# Altium project Dashcam_V2.0E.PrjPcb (part 2 of 8)

## Sheet CPU MISC.SchDoc: CPU MISC
size A3; DrawnBy: UKAYACIK; Engineer: UKAYACIK; DocumentNumber: 6; Revision: B; SheetNumber: 7; SheetTotal: 21
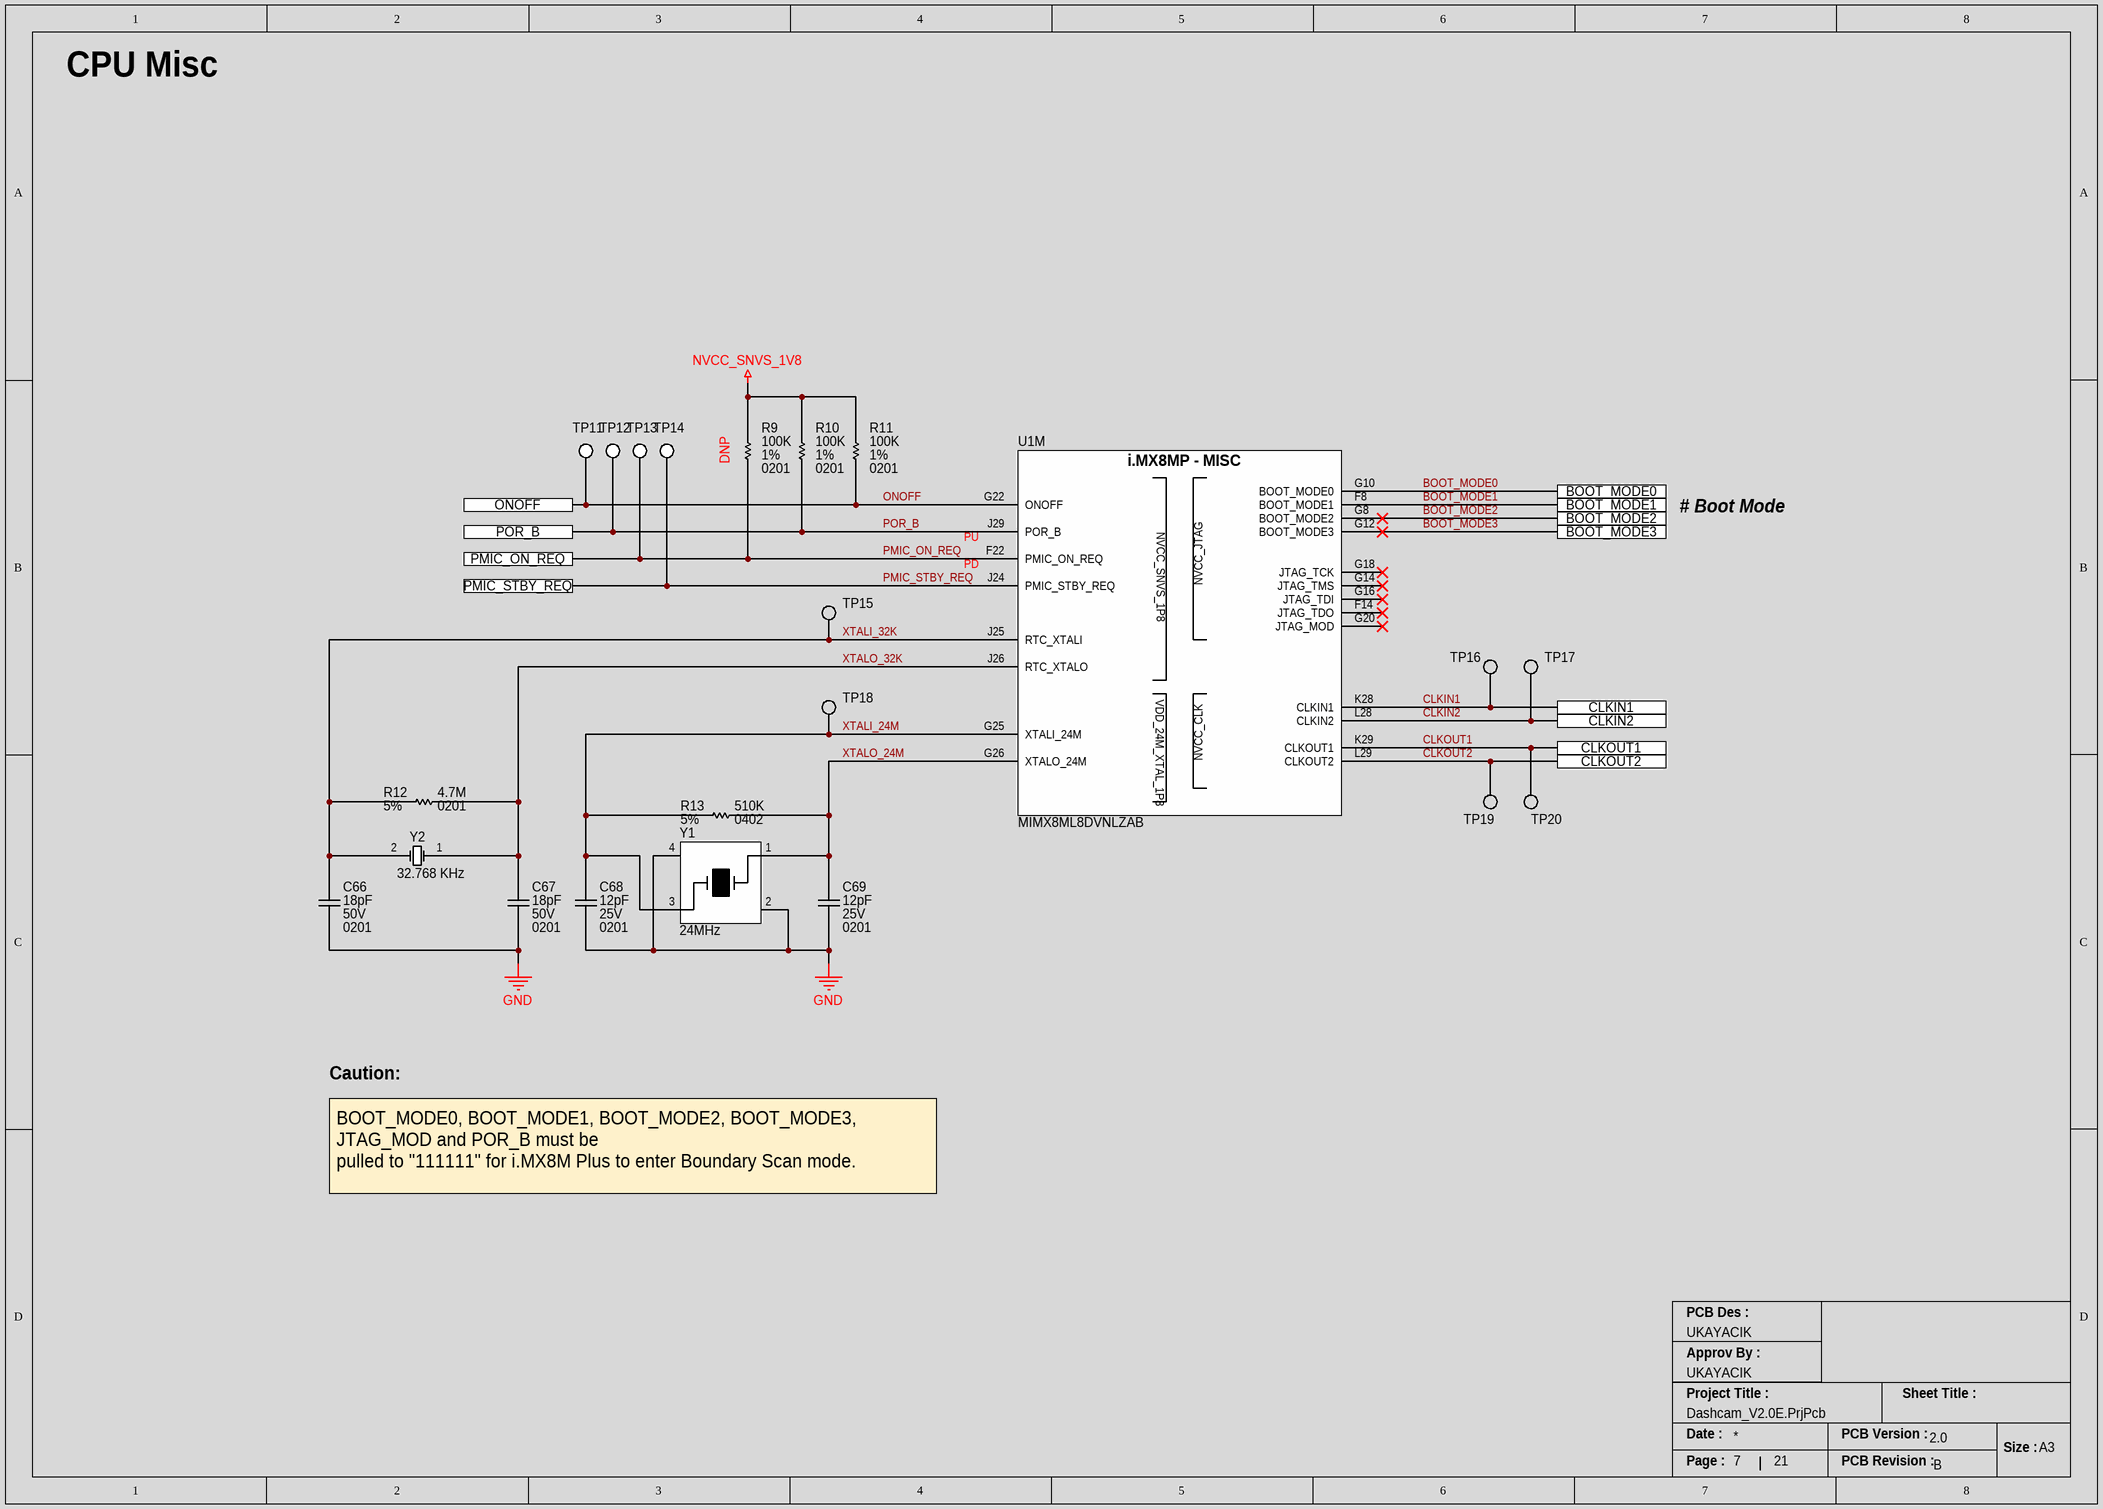
[diagram p7: CPU MISC.SchDoc]

### Parts
C66  Capacitance: 18pF  Voltage Rating: 50V  Case/Package: 0201  [CAP_0201_CAPC0603X03N]  (hidden comment: GRM0335C1H180JA01D)
C67  Capacitance: 18pF  Voltage Rating: 50V  Case/Package: 0201  [CAP_0201_CAPC0603X03N]  (hidden comment: GRM0335C1H180JA01D)
C68  Voltage Rating: 25V  Capacitance: 12pF  Case/Package: 0201  [CAP_0201_CAPC0603X03N]  (hidden comment: CGA1A2C0G1E120J030BA)
C69  Voltage Rating: 25V  Capacitance: 12pF  Case/Package: 0201  [CAP_0201_CAPC0603X03N]  (hidden comment: CGA1A2C0G1E120J030BA)
R9  Resistance: 100K  Tolerance: 1%  Case/Package: 0201  [RES_0201_RESC0603X02N]  (hidden comment: RC0201FR-07100KL)
R10  Resistance: 100K  Tolerance: 1%  Case/Package: 0201  [RES_0201_RESC0603X02N]  (hidden comment: RC0201FR-07100KL)
R11  Resistance: 100K  Tolerance: 1%  Case/Package: 0201  [RES_0201_RESC0603X02N]  (hidden comment: RC0201FR-07100KL)
R12  Tolerance: 5%  Resistance: 4.7M  Case/Package: 0201  [RES_0201_RESC0603X02N]  (hidden comment: RC0201JR-074M7L)
R13  Tolerance: 5%  Resistance: 510K  Case/Package: 0402  [RES_0402_RESC1005X04N]  (hidden comment: ERJ-2GEJ514X)
TP11  NO COMPONENT  [TP_PAD_0.8MM_SMD_ROUND]  (value not drawn)  (no BOM)
TP12  NO COMPONENT  [TP_PAD_0.8MM_SMD_ROUND]  (value not drawn)  (no BOM)
TP13  NO COMPONENT  [TP_PAD_0.8MM_SMD_ROUND]  (value not drawn)  (no BOM)
TP14  NO COMPONENT  [TP_PAD_0.8MM_SMD_ROUND]  (value not drawn)  (no BOM)
TP15  NO COMPONENT  [TP_PAD_0.5MM_SMD_ROUND]  (value not drawn)  (no BOM)
TP16  NO COMPONENT  [TP_PAD_0.5MM_SMD_ROUND]  (value not drawn)  (no BOM)
TP17  NO COMPONENT  [TP_PAD_0.5MM_SMD_ROUND]  (value not drawn)  (no BOM)
TP18  NO COMPONENT  [TP_PAD_0.5MM_SMD_ROUND]  (value not drawn)  (no BOM)
TP19  NO COMPONENT  [TP_PAD_0.5MM_SMD_ROUND]  (value not drawn)  (no BOM)
TP20  NO COMPONENT  [TP_PAD_0.5MM_SMD_ROUND]  (value not drawn)  (no BOM)
U1  MIMX8ML8DVNLZAB  [IC_MPU_BGA548C50P29X29_1500X1500X148]  (part M of 15)
Y1  Frequency: 24MHz  [CRYSTAL_24MHz_OSCCC320X250X60]  (hidden comment: TSX-3225 24.0000MF15X-AC3)
Y2  Operating Frequency: 32.768 KHz  [CRYSTAL_ABS07-32.768KHZ-T]  (hidden comment: ABS07-32.768KHZ-T)

### Ports
BOOT_MODE0, BOOT_MODE1, BOOT_MODE2, BOOT_MODE3, CLKIN1, CLKIN2, CLKOUT1, CLKOUT2, ONOFF, PMIC_ON_REQ, PMIC_STBY_REQ, POR_B

### Nets
GND: C66.1 C67.1 C68.1 C69.1 Y1.2 Y1.4
NVCC_SNVS_1V8: R9.2 R10.2 R11.2
BOOT_MODE0: U1.G10(BOOT_MODE0) ; port BOOT_MODE0
BOOT_MODE1: U1.F8(BOOT_MODE1) ; port BOOT_MODE1
BOOT_MODE2: U1.G8(BOOT_MODE2) ; port BOOT_MODE2
BOOT_MODE3: U1.G12(BOOT_MODE3) ; port BOOT_MODE3
CLKIN1: TP16.1 U1.K28(CLKIN1) ; port CLKIN1
CLKIN2: TP17.1 U1.L28(CLKIN2) ; port CLKIN2
CLKOUT1: TP20.1 U1.K29(CLKOUT1) ; port CLKOUT1
CLKOUT2: TP19.1 U1.L29(CLKOUT2) ; port CLKOUT2
ONOFF: R11.1 TP11.1 U1.G22(ONOFF) ; port ONOFF
PMIC_ON_REQ: R9.1 TP13.1 U1.F22(PMIC_ON_REQ) ; port PMIC_ON_REQ
PMIC_STBY_REQ: TP14.1 U1.J24(PMIC_STBY_REQ) ; port PMIC_STBY_REQ
POR_B: R10.1 TP12.1 U1.J29(POR_B) ; port POR_B
XTALI_24M: C68.2 R13.1 TP18.1 U1.G25(XTALI_24M) Y1.3
XTALI_32K: C66.2 R12.1 TP15.1 U1.J25(RTC_XTALI) Y2.2(OSC2)
XTALO_24M: C69.2 R13.2 U1.G26(XTALO_24M) Y1.1
XTALO_32K: C67.2 R12.2 U1.J26(RTC_XTALO) Y2.1(OSC1)

Not connected (* = marked no-connect by the designer): U1 F14(JTAG_TDO)* G14(JTAG_TMS)* G16(JTAG_TDI)* G18(JTAG_TCK)* G20(JTAG_MOD)*

### Notes on the sheet
- CPU Misc
- (near R9) DNP
- # Boot Mode
- (near U1) PD
- (near U1) PU
- Caution:
- BOOT_MODE0, BOOT_MODE1, BOOT_MODE2, BOOT_MODE3, JTAG_MOD and POR_B must be
  pulled to "111111" for i.MX8M Plus to enter Boundary Scan mode.
- PCB Des :
- Approv By :
- Project Title :
- Sheet Title :
- Date :
- PCB Version :
- Size :
- A3
- Page :
- PCB Revision :
- (in symbol IC_MPU_8M_PLUS_MIMX8ML8DVNLZAB, part M) i.MX8MP - MISC

### Library data of the parts
C66 C67 = CAP_18PF_50V_NP0_0201: Multilayer Ceramic Capacitor, 18 pF, 50 V, ± 5%, C0G (NP0), 0201 [0603 Metric]; Manufacturer: Murata; Temperature Coefficient: 30ppm/°C; Supplier 1: Digikey; Manufacturer Part Number: GRM0335C1H180JA01D; RoHS: Yes; Category: Ceramic Capacitors; Stock 1: 464126; Pricing 1: 1=0.1, 10=0.011, 50=0.0062, 100=0.0048, 500=0.0036, 1000=0.00283, 2500=0.00258, 5000=0.00237 (USD); Mount: Surface Mount; Case Code (Metric): 0603; Case Code (Imperial): 0201; Material: Ceramic; Min Operating Temperature: -55°C; Max Operating Temperature: 125°C; Package Quantity: 15000; Packaging: Tape and Reel; Voltage Rating (DC): 50V; Termination: SMD/SMT; Series: GRM; Dielectric: C0G; Tolerance: 5%; Voltage: 50V; Length: 0.6mm; Width: 0.3mm; Height: 0.3mm; Depth: 0.3mm; Radiation Hardening: No; RoHS Compliant: Yes; Lead Free: Lead Free; Supplier Part Number 1: 490-6117-1-ND
C68 C69 = CAP_12PF_25V_NP0_0201: CAPACITORS CERAMIC, 12PF, 5%, 25V, C0G, 0201[0603]; Product Range: TDK - CGA Seri; Supplier 1: Mouser; Manufacturer: TDK; Manufacturer Part Number: CGA1A2C0G1E120J030BA; RoHS: Yes; Category: Ceramic Capacitors; Stock 1: 58112; Pricing 1: 1=0.1, 10=0.041, 50=0.041, 100=0.024, 1000=0.017, 10000=0.014 (USD); Mount: Surface Mount; Case Code (Metric): 0603; Case Code (Imperial): 0201; Weight: 6E-06oz; Min Operating Temperature: -55°C; Max Operating Temperature: 125°C; Tolerance: 5%; Packaging: Tape and Reel; Termination: SMD/SMT; Series: CGA; Package Quantity: 15000; Voltage Rating (DC): 25V; Dielectric: C0G; Length: 0.6mm; Width: 0.3mm; Height: 0.3mm; Depth: 0.3mm; Ratings: AEC-Q200; RoHS Compliant: Yes; ComponentLink1URL: https://datasheet.ciiva.com/24221/cga1a2c0g1e120j030ba-271847-24221437.pdf?src-supplier=Mouser; ComponentLink1Description: https://datasheet.ciiva.com/24221/cga1a2c0g1e120j030ba-271847-24221437.pdf?src-supplier=Mouser; Supplier Part Number 1: 810-CGA1A2C0G1E120J
R9-R11 = RES_100K_1%_50mW_0201: SMD Chip Resistor, 100 kOhm, ± 1%, 50 mW, 0201 [0603 Metric], Thick Film, General Purpose; Manufacturer: Yageo; Temperature Coefficient: 200ppm/°C; Power Rating: 50mW; Voltage Rating: 25V; Supplier 1: Digikey; Manufacturer Part Number: RC0201FR-07100KL; RoHS: Yes; Category: Chip SMD Resistors; Stock 1: 2564699; Pricing 1: 1=0.1, 10=0.027, 50=0.0172, 100=0.0143, 500=0.00988, 1000=0.00854, 5000=0.00629 (USD); Number of Pins: 2NUMBER; Contact Plating: Tin,Matte; Case Code (Imperial): 0201; Case Code (Metric): 0603; Size Code: 0201; Min Operating Temperature: -55°C; Max Operating Temperature: 125°C; Resistor Type: Thick Film; Packaging: Tape and Reel; Package Quantity: 10000; Termination: SMD/SMT; Number of Terminations: 2; Max Power Dissipation: 50mW; Features: Moisture Resistant; Series: RC; Resistance Tolerance: 1%; Construction: Rectangular; Voltage Rating (DC): 25V; Length: 0.024inch; Width: 0.012inch; Height: 0.01inch; Depth: 0.3mm; Reach SVHC Compliant: No; Military Standard: Not; RoHS Compliant: Yes; Lead Free: 5697LeadFree; ComponentLink1URL: https://datasheet.ciiva.com/2493/pyu-r-int-thick-7-2493769.pdf?src-supplier=Digikey; ComponentLink1Description: https://datasheet.ciiva.com/2493/pyu-r-int-thick-7-2493769.pdf?src-supplier=Digikey; ComponentLink2URL: https://datasheet.ciiva.com/2493/pyu-r-int-thick-7-2493770.pdf?src-supplier=Digikey; ComponentLink2Description: https://datasheet.ciiva.com/2493/pyu-r-int-thick-7-2493770.pdf?src-supplier=Digikey; ComponentLink3URL: https://datasheet.ciiva.com/2493/pyu-r-int-thick-7-2493771.pdf?src-supplier=Digikey; ComponentLink3Description: https://datasheet.ciiva.com/2493/pyu-r-int-thick-7-2493771.pdf?src-supplier=Digikey; ComponentLink4URL: https://datasheet.ciiva.com/26829/getdatasheetpartid-420441-26829850.pdf?src-supplier=Verical; ComponentLink4Description: https://datasheet.ciiva.com/26829/getdatasheetpartid-420441-26829850.pdf?src-supplier=Verical; ComponentLink5URL: https://datasheet.ciiva.com/22698/1563626-22698495.pdf?src-supplier=Element14; ComponentLink5Description: https://datasheet.ciiva.com/22698/1563626-22698495.pdf?src-supplier=Element14; ComponentLink6URL: https://datasheet.ciiva.com/7660/1421516-7660806.pdf?src-supplier=Element14; ComponentLink6Description: https://datasheet.ciiva.com/7660/1421516-7660806.pdf?src-supplier=Element14; ComponentLink7URL: https://datasheet.ciiva.com/46391/1421516-46391338.pdf?src-supplier=Element14; ComponentLink7Description: https://datasheet.ciiva.com/46391/1421516-46391338.pdf?src-supplier=Element14; Supplier Part Number 1: 311-100KMDKR-ND
R12 = RES_4.7M_5%_50mW_0201: SMD Chip Resistor, 4.7 MOhm, ± 5%, 50 mW, 0201 [0603 Metric], Thick Film, General Purpose; Manufacturer: Yageo; Max Power Dissipation: 50mW; Temperature Coefficient: 200ppm/°C; Supplier 1: Digikey; Manufacturer Part Number: RC0201JR-074M7L; RoHS: Yes; Category: Chip SMD Resistors; Stock 1: 74834; Pricing 1: 1=0.1, 10=0.021, 50=0.0132, 100=0.011, 500=0.00746, 1000=0.00643, 5000=0.00468 (USD); Case Code (Metric): 0603; Case Code (Imperial): 0201; Min Operating Temperature: -55°C; Max Operating Temperature: 125°C; Packaging: Cut Tape; Number of Terminations: 2; Features: Moisture Resistant; Series: RC; RoHS Compliant: Yes; ComponentLink1URL: http://www.yageo.com/documents/recent/PYu-RC_Group_51_RoHS_L_9.pdf?src-supplier=Digikey; ComponentLink1Description: http://www.yageo.com/documents/recent/PYu-RC_Group_51_RoHS_L_9.pdf?src-supplier=Digikey; ComponentLink2URL: https://www.yageo.com/upload/media/product/productsearch/datasheet/rchip/PYu-RC_Group_51_RoHS_L_11.pdf?src-supplier=Digikey; ComponentLink2Description: https://www.yageo.com/upload/media/product/productsearch/datasheet/rchip/PYu-RC_Group_51_RoHS_L_11.pdf?src-supplier=Digikey; ComponentLink3URL: https://datasheet.octopart.com/RC0201JR-074M7L-Yageo-datasheet-164759695.pdf?src-supplier=Future+Electronics; ComponentLink3Description: https://datasheet.octopart.com/RC0201JR-074M7L-Yageo-datasheet-164759695.pdf?src-supplier=Future+Electronics; Supplier Part Number 1: YAG2904CT-ND
R13 = RES_510K_5%_100mW_0402: SMD Chip Resistor, 510 kOhm, ± 5%, 100 mW, 0402 [1005 Metric], Thick Film, General Purpose; Manufacturer: Panasonic; Power Rating: 100mW; Voltage Rating: 50V; Temperature Coefficient: 200ppm/°C; Supplier 1: Digikey; Manufacturer Part Number: ERJ-2GEJ514X; RoHS: Yes; Category: Chip SMD Resistors; Stock 1: 171465; Pricing 1: 1=0.1, 10=0.022, 50=0.0134, 100=0.0112, 500=0.00758, 1000=0.00651, 5000=0.00473 (USD); Mount: Surface Mount; Case Code (Imperial): 0402; Case Code (Metric): 1005; Weight: 2.8E-05oz; Contact Plating: Tin; Min Operating Temperature: -55°C; Max Operating Temperature: 155°C; Packaging: Tape and Reel; Package Quantity: 10000; Resistor Type: Thick Film; Number of Terminations: 2; Max Power Dissipation: 100mW; Voltage Rating (DC): 50V; Features: Automotive AEC-Q200; Series: ERJ; Resistance Tolerance: 5%; Termination: SMD/SMT; Construction: Rectangular; Technology: THICK FILM; Length: 1mm; Width: 0.5mm; Height: 0.35mm; Depth: 0.5mm; Ratings: AEC-Q200; Radiation Hardening: No; Reach SVHC Compliant: No; Lead Free: Lead Free; RoHS Compliant: Yes; Military Standard: Not; ComponentLink1URL: https://datasheet.ciiva.com/11821/0900766b80f806dd-11821324.pdf?src-supplier=Rs; ComponentLink1Description: https://datasheet.ciiva.com/11821/0900766b80f806dd-11821324.pdf?src-supplier=Rs; ComponentLink2URL: https://datasheet.ciiva.com/30121/4aoa0000ce1-30121622.pdf?src-supplier=Onlinecomponents.com; ComponentLink2Description: https://datasheet.ciiva.com/30121/4aoa0000ce1-30121622.pdf?src-supplier=Onlinecomponents.com; ComponentLink3URL: https://datasheet.ciiva.com/8079/1678796-8079437.pdf?src-supplier=Element14; ComponentLink3Description: https://datasheet.ciiva.com/8079/1678796-8079437.pdf?src-supplier=Element14; Supplier Part Number 1: P510KJCT-ND
TP11-TP14 = TP_PAD_SMD_Round: Test Point, SMD pad, round, 1.5mm, 1.6mm, 3mm diameter
TP15-TP20 = TP_PAD_SMD_SMALL: as TP21 on sheet CPU IO
U1 = IC_MPU_8M_PLUS_MIMX8ML8DVNLZAB: as U1 on sheet CPU IO; Supplier 1: Arrow Electronics; Manufacturer Part Number: MIMX8ML8DVNLZAB; RoHS: Yes; Category: Microprocessors; Stock 1: 1036; Pricing 1: 1=54.8, 5=52.24, 10=44.19, 25=42.8, 50=39.95, 100=31.83 (USD); Supplier Part Number 1: MIMX8ML8DVNLZAB
Y1 = CRYSTAL_EPSON_24MHz_TSX-3225 24.0000MF15X-AC3: 24 MHz ±10ppm Crystal 9pF 40 Ohms 4-SMD, No Lead; Manufacturer: Epson; Supplier 1: Digi-Key; Manufacturer Part Number: TSX-3225 24.0000MF15X-AC3; RoHS: Yes; Category: Crystals; Mount: Surface Mount; Case/Package: SMD/SMT; Min Operating Temperature: -40°C; Max Operating Temperature: 85°C; Load Capacitance: 9pF; Frequency Tolerance: 10ppm; Series: FC-135; RoHS Compliant: Yes
Y2 = CRYSTAL_ABRACON_32.768KHz_ABS07-32.768KHZ-T: Crystal 0.032768MHz ±20ppm (Tol) 12.5pF Flexural 70000Ohm 2-Pin CSMD T/R; ESR (Equivalent Series Resistance): 70kR; Supplier 1: Digikey; Manufacturer: Abracon; Manufacturer Part Number: ABS07-32.768KHZ-T; RoHS: Yes; Category: Crystals; Stock 1: 1583168; Pricing 1: 1=0.69, 10=0.576, 50=0.5184, 100=0.4607, 500=0.43768, 1000=0.36858 (USD); Case/Package: CSMD; Number of Pins: 2; Min Operating Temperature: -40°C; Max Operating Temperature: 85°C; Frequency Tolerance: 20ppm; Load Capacitance: 12.5pF; Frequency: 32.768kHz; Packaging: Tape and Reel; Series: ABS07; Package Quantity: 3000; Tolerance: 20ppm; Termination: SMD/SMT; Series Resistance: 70kR; Length: 3.2mm; Width: 1.5mm; Height: 0.9mm; Depth: 1.5mm; Radiation Hardening: No; RoHS Compliant: Yes; Lead Free: Lead Free; Reach SVHC Compliant: No; ComponentLink1URL: https://datasheet.ciiva.com/7998/1912628-7998667.pdf?src-supplier=Element14; ComponentLink1Description: https://datasheet.ciiva.com/7998/1912628-7998667.pdf?src-supplier=Element14; ComponentLink2URL: https://datasheet.ciiva.com/1357/1883680-1357319.pdf?src-supplier=Element14; ComponentLink2Description: https://datasheet.ciiva.com/1357/1883680-1357319.pdf?src-supplier=Element14; ComponentLink3URL: https://datasheet.ciiva.com/854/abs07-854936.pdf?src-supplier=Digikey; ComponentLink3Description: https://datasheet.ciiva.com/854/abs07-854936.pdf?src-supplier=Digikey; ComponentLink4URL: https://datasheet.ciiva.com/854/abs07-854935.pdf?src-supplier=Digikey; ComponentLink4Description: https://datasheet.ciiva.com/854/abs07-854935.pdf?src-supplier=Digikey; ComponentLink5URL: https://datasheet.ciiva.com/854/abs07-854937.pdf?src-supplier=Digikey; ComponentLink5Description: https://datasheet.ciiva.com/854/abs07-854937.pdf?src-supplier=Digikey; ComponentLink6URL: https://datasheet.ciiva.com/4944/abs07-11028-4944830.pdf?src-supplier=Mouser; ComponentLink6Description: https://datasheet.ciiva.com/4944/abs07-11028-4944830.pdf?src-supplier=Mouser; Supplier Part Number 1: 535-9542-1-ND

## Sheet CPU Power.SchDoc: CPU POWER
size A2; DrawnBy: UKAYACIK; Engineer: UKAYACIK; DocumentNumber: 3; Revision: B; SheetNumber: 4; SheetTotal: 21
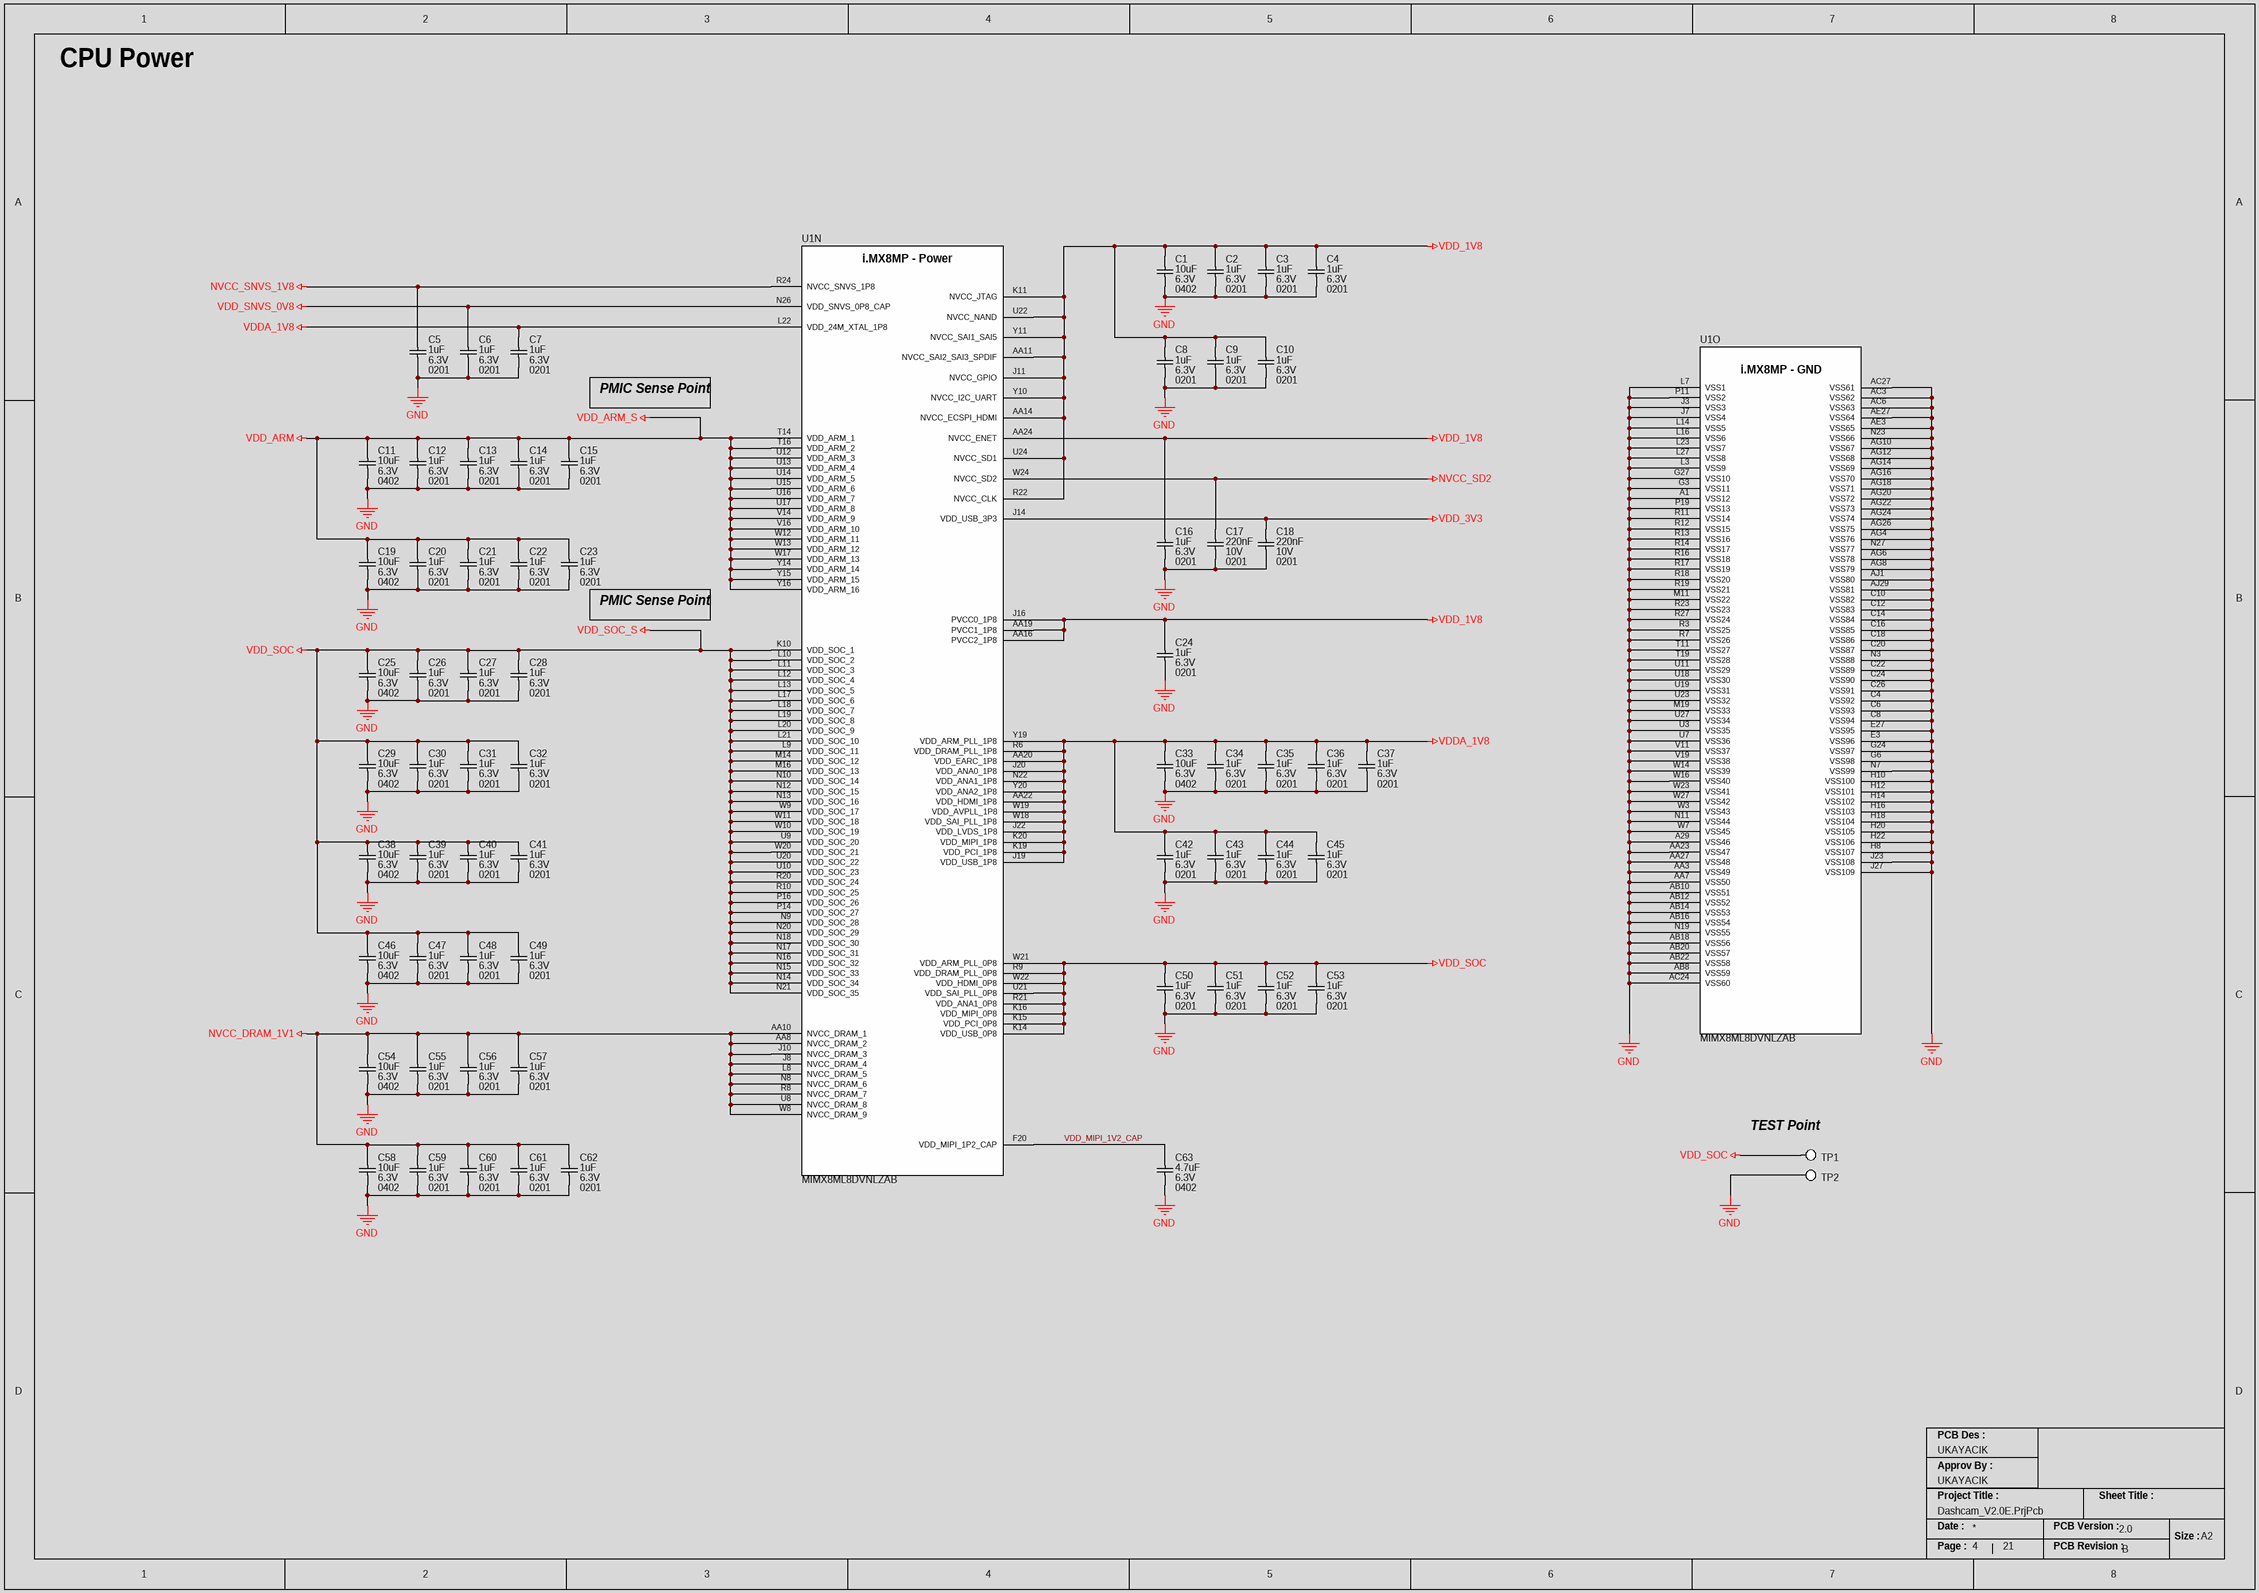
[diagram p8: CPU Power.SchDoc]

### Parts
C1  Case/Package: 0402  Capacitance: 10uF  Voltage Rating: 6.3V  [CAP_0402_CAPC1005X05N]  (hidden comment: CL05A106MQ5NUNC)
C2  Voltage Rating (DC): 6.3V  Capacitance: 1uF  Case/Package: 0201  [CAP_0201_CAPC0603X03N]  (hidden comment: 02016D105MAT2A)
C3  Voltage Rating (DC): 6.3V  Capacitance: 1uF  Case/Package: 0201  [CAP_0201_CAPC0603X03N]  (hidden comment: 02016D105MAT2A)
C4  Voltage Rating (DC): 6.3V  Capacitance: 1uF  Case/Package: 0201  [CAP_0201_CAPC0603X03N]  (hidden comment: 02016D105MAT2A)
C5  Voltage Rating (DC): 6.3V  Capacitance: 1uF  Case/Package: 0201  [CAP_0201_CAPC0603X03N]  (hidden comment: 02016D105MAT2A)
C6  Voltage Rating (DC): 6.3V  Capacitance: 1uF  Case/Package: 0201  [CAP_0201_CAPC0603X03N]  (hidden comment: 02016D105MAT2A)
C7  Voltage Rating (DC): 6.3V  Capacitance: 1uF  Case/Package: 0201  [CAP_0201_CAPC0603X03N]  (hidden comment: 02016D105MAT2A)
C8  Voltage Rating (DC): 6.3V  Capacitance: 1uF  Case/Package: 0201  [CAP_0201_CAPC0603X03N]  (hidden comment: 02016D105MAT2A)
C9  Voltage Rating (DC): 6.3V  Capacitance: 1uF  Case/Package: 0201  [CAP_0201_CAPC0603X03N]  (hidden comment: 02016D105MAT2A)
C10  Voltage Rating (DC): 6.3V  Capacitance: 1uF  Case/Package: 0201  [CAP_0201_CAPC0603X03N]  (hidden comment: 02016D105MAT2A)
C11  Case/Package: 0402  Capacitance: 10uF  Voltage Rating: 6.3V  [CAP_0402_CAPC1005X05N]  (hidden comment: CL05A106MQ5NUNC)
C12  Voltage Rating (DC): 6.3V  Capacitance: 1uF  Case/Package: 0201  [CAP_0201_CAPC0603X03N]  (hidden comment: 02016D105MAT2A)
C13  Voltage Rating (DC): 6.3V  Capacitance: 1uF  Case/Package: 0201  [CAP_0201_CAPC0603X03N]  (hidden comment: 02016D105MAT2A)
C14  Voltage Rating (DC): 6.3V  Capacitance: 1uF  Case/Package: 0201  [CAP_0201_CAPC0603X03N]  (hidden comment: 02016D105MAT2A)
C15  Voltage Rating (DC): 6.3V  Capacitance: 1uF  Case/Package: 0201  [CAP_0201_CAPC0603X03N]  (hidden comment: 02016D105MAT2A)
C16  Voltage Rating (DC): 6.3V  Capacitance: 1uF  Case/Package: 0201  [CAP_0201_CAPC0603X03N]  (hidden comment: 02016D105MAT2A)
C17  Voltage Rating (DC): 10V  Capacitance: 220nF  Case/Package: 0201  [CAP_0201_CAPC0603X03N]  (hidden comment: LMK063BJ224MP-F)
C18  Voltage Rating (DC): 10V  Capacitance: 220nF  Case/Package: 0201  [CAP_0201_CAPC0603X03N]  (hidden comment: LMK063BJ224MP-F)
C19  Case/Package: 0402  Capacitance: 10uF  Voltage Rating: 6.3V  [CAP_0402_CAPC1005X05N]  (hidden comment: CL05A106MQ5NUNC)
C20  Voltage Rating (DC): 6.3V  Capacitance: 1uF  Case/Package: 0201  [CAP_0201_CAPC0603X03N]  (hidden comment: 02016D105MAT2A)
C21  Voltage Rating (DC): 6.3V  Capacitance: 1uF  Case/Package: 0201  [CAP_0201_CAPC0603X03N]  (hidden comment: 02016D105MAT2A)
C22  Voltage Rating (DC): 6.3V  Capacitance: 1uF  Case/Package: 0201  [CAP_0201_CAPC0603X03N]  (hidden comment: 02016D105MAT2A)
C23  Voltage Rating (DC): 6.3V  Capacitance: 1uF  Case/Package: 0201  [CAP_0201_CAPC0603X03N]  (hidden comment: 02016D105MAT2A)
C24  Voltage Rating (DC): 6.3V  Capacitance: 1uF  Case/Package: 0201  [CAP_0201_CAPC0603X03N]  (hidden comment: 02016D105MAT2A)
C25  Case/Package: 0402  Capacitance: 10uF  Voltage Rating: 6.3V  [CAP_0402_CAPC1005X05N]  (hidden comment: CL05A106MQ5NUNC)
C26  Voltage Rating (DC): 6.3V  Capacitance: 1uF  Case/Package: 0201  [CAP_0201_CAPC0603X03N]  (hidden comment: 02016D105MAT2A)
C27  Voltage Rating (DC): 6.3V  Capacitance: 1uF  Case/Package: 0201  [CAP_0201_CAPC0603X03N]  (hidden comment: 02016D105MAT2A)
C28  Voltage Rating (DC): 6.3V  Capacitance: 1uF  Case/Package: 0201  [CAP_0201_CAPC0603X03N]  (hidden comment: 02016D105MAT2A)
C29  Case/Package: 0402  Capacitance: 10uF  Voltage Rating: 6.3V  [CAP_0402_CAPC1005X05N]  (hidden comment: CL05A106MQ5NUNC)
C30  Voltage Rating (DC): 6.3V  Capacitance: 1uF  Case/Package: 0201  [CAP_0201_CAPC0603X03N]  (hidden comment: 02016D105MAT2A)
C31  Voltage Rating (DC): 6.3V  Capacitance: 1uF  Case/Package: 0201  [CAP_0201_CAPC0603X03N]  (hidden comment: 02016D105MAT2A)
C32  Voltage Rating (DC): 6.3V  Capacitance: 1uF  Case/Package: 0201  [CAP_0201_CAPC0603X03N]  (hidden comment: 02016D105MAT2A)
C33  Case/Package: 0402  Capacitance: 10uF  Voltage Rating: 6.3V  [CAP_0402_CAPC1005X05N]  (hidden comment: CL05A106MQ5NUNC)
C34  Voltage Rating (DC): 6.3V  Capacitance: 1uF  Case/Package: 0201  [CAP_0201_CAPC0603X03N]  (hidden comment: 02016D105MAT2A)
C35  Voltage Rating (DC): 6.3V  Capacitance: 1uF  Case/Package: 0201  [CAP_0201_CAPC0603X03N]  (hidden comment: 02016D105MAT2A)
C36  Voltage Rating (DC): 6.3V  Capacitance: 1uF  Case/Package: 0201  [CAP_0201_CAPC0603X03N]  (hidden comment: 02016D105MAT2A)
C37  Voltage Rating (DC): 6.3V  Capacitance: 1uF  Case/Package: 0201  [CAP_0201_CAPC0603X03N]  (hidden comment: 02016D105MAT2A)
C38  Case/Package: 0402  Capacitance: 10uF  Voltage Rating: 6.3V  [CAP_0402_CAPC1005X05N]  (hidden comment: CL05A106MQ5NUNC)
C39  Voltage Rating (DC): 6.3V  Capacitance: 1uF  Case/Package: 0201  [CAP_0201_CAPC0603X03N]  (hidden comment: 02016D105MAT2A)
C40  Voltage Rating (DC): 6.3V  Capacitance: 1uF  Case/Package: 0201  [CAP_0201_CAPC0603X03N]  (hidden comment: 02016D105MAT2A)
C41  Voltage Rating (DC): 6.3V  Capacitance: 1uF  Case/Package: 0201  [CAP_0201_CAPC0603X03N]  (hidden comment: 02016D105MAT2A)
C42  Voltage Rating (DC): 6.3V  Capacitance: 1uF  Case/Package: 0201  [CAP_0201_CAPC0603X03N]  (hidden comment: 02016D105MAT2A)
C43  Voltage Rating (DC): 6.3V  Capacitance: 1uF  Case/Package: 0201  [CAP_0201_CAPC0603X03N]  (hidden comment: 02016D105MAT2A)
C44  Voltage Rating (DC): 6.3V  Capacitance: 1uF  Case/Package: 0201  [CAP_0201_CAPC0603X03N]  (hidden comment: 02016D105MAT2A)
C45  Voltage Rating (DC): 6.3V  Capacitance: 1uF  Case/Package: 0201  [CAP_0201_CAPC0603X03N]  (hidden comment: 02016D105MAT2A)
C46  Case/Package: 0402  Capacitance: 10uF  Voltage Rating: 6.3V  [CAP_0402_CAPC1005X05N]  (hidden comment: CL05A106MQ5NUNC)
C47  Voltage Rating (DC): 6.3V  Capacitance: 1uF  Case/Package: 0201  [CAP_0201_CAPC0603X03N]  (hidden comment: 02016D105MAT2A)
C48  Voltage Rating (DC): 6.3V  Capacitance: 1uF  Case/Package: 0201  [CAP_0201_CAPC0603X03N]  (hidden comment: 02016D105MAT2A)
C49  Voltage Rating (DC): 6.3V  Capacitance: 1uF  Case/Package: 0201  [CAP_0201_CAPC0603X03N]  (hidden comment: 02016D105MAT2A)
C50  Voltage Rating (DC): 6.3V  Capacitance: 1uF  Case/Package: 0201  [CAP_0201_CAPC0603X03N]  (hidden comment: 02016D105MAT2A)
C51  Voltage Rating (DC): 6.3V  Capacitance: 1uF  Case/Package: 0201  [CAP_0201_CAPC0603X03N]  (hidden comment: 02016D105MAT2A)
C52  Voltage Rating (DC): 6.3V  Capacitance: 1uF  Case/Package: 0201  [CAP_0201_CAPC0603X03N]  (hidden comment: 02016D105MAT2A)
C53  Voltage Rating (DC): 6.3V  Capacitance: 1uF  Case/Package: 0201  [CAP_0201_CAPC0603X03N]  (hidden comment: 02016D105MAT2A)
C54  Case/Package: 0402  Capacitance: 10uF  Voltage Rating: 6.3V  [CAP_0402_CAPC1005X05N]  (hidden comment: CL05A106MQ5NUNC)
C55  Voltage Rating (DC): 6.3V  Capacitance: 1uF  Case/Package: 0201  [CAP_0201_CAPC0603X03N]  (hidden comment: 02016D105MAT2A)
C56  Voltage Rating (DC): 6.3V  Capacitance: 1uF  Case/Package: 0201  [CAP_0201_CAPC0603X03N]  (hidden comment: 02016D105MAT2A)
C57  Voltage Rating (DC): 6.3V  Capacitance: 1uF  Case/Package: 0201  [CAP_0201_CAPC0603X03N]  (hidden comment: 02016D105MAT2A)
C58  Case/Package: 0402  Capacitance: 10uF  Voltage Rating: 6.3V  [CAP_0402_CAPC1005X05N]  (hidden comment: CL05A106MQ5NUNC)
C59  Voltage Rating (DC): 6.3V  Capacitance: 1uF  Case/Package: 0201  [CAP_0201_CAPC0603X03N]  (hidden comment: 02016D105MAT2A)
C60  Voltage Rating (DC): 6.3V  Capacitance: 1uF  Case/Package: 0201  [CAP_0201_CAPC0603X03N]  (hidden comment: 02016D105MAT2A)
C61  Voltage Rating (DC): 6.3V  Capacitance: 1uF  Case/Package: 0201  [CAP_0201_CAPC0603X03N]  (hidden comment: 02016D105MAT2A)
C62  Voltage Rating (DC): 6.3V  Capacitance: 1uF  Case/Package: 0201  [CAP_0201_CAPC0603X03N]  (hidden comment: 02016D105MAT2A)
C63  Capacitance: 4.7uF  Voltage Rating: 6.3V  Case/Package: 0402  [CAP_0402_CAPC1005X05N]  (hidden comment: C1005X5R0J475M050BC)
TP1  NO COMPONENT  [TP_PAD_0.8MM_SMD_ROUND]  (value not drawn)  (no BOM)
TP2  NO COMPONENT  [TP_PAD_0.8MM_SMD_ROUND]  (value not drawn)  (no BOM)
U1  MIMX8ML8DVNLZAB  [IC_MPU_BGA548C50P29X29_1500X1500X148]  (parts N,O of 15)

### Nets
GND: C1.1 C2.1 C3.1 C4.1 C5.1 C6.1 C7.1 C8.1 C9.1 C10.1 C11.1 C12.1 C13.1 C14.1 C15.1 C16.1 C17.1 C18.1 C19.1 C20.1 C21.1 C22.1 C23.1 C24.1 C25.1 C26.1 C27.1 C28.1 C29.1 C30.1 C31.1 C32.1 C33.1 C34.1 C35.1 C36.1 C37.1 C38.1 C39.1 C40.1 C41.1 C42.1 C43.1 C44.1 C45.1 C46.1 C47.1 C48.1 C49.1 C50.1 C51.1 C52.1 C53.1 C54.1 C55.1 C56.1 C57.1 C58.1 C59.1 C60.1 C61.1 C62.1 C63.1 TP2.1 U1.A1(VSS12) U1.A29(VSS46) U1.AA3(VSS49) U1.AA7(VSS50) U1.AA23(VSS47) U1.AA27(VSS48) U1.AB8(VSS59) U1.AB10(VSS51) U1.AB12(VSS52) U1.AB14(VSS53) U1.AB16(VSS54) U1.AB18(VSS56) U1.AB20(VSS57) U1.AB22(VSS58) U1.AC3(VSS62) U1.AC6(VSS63) U1.AC24(VSS60) U1.AC27(VSS61) U1.AE3(VSS65) U1.AE27(VSS64) U1.AG4(VSS76) U1.AG6(VSS78) U1.AG8(VSS79) U1.AG10(VSS67) U1.AG12(VSS68) U1.AG14(VSS69) U1.AG16(VSS70) U1.AG18(VSS71) U1.AG20(VSS72) U1.AG22(VSS73) U1.AG24(VSS74) U1.AG26(VSS75) U1.AJ1(VSS80) U1.AJ29(VSS81) U1.C4(VSS92) U1.C6(VSS93) U1.C8(VSS94) U1.C10(VSS82) U1.C12(VSS83) U1.C14(VSS84) U1.C16(VSS85) U1.C18(VSS86) U1.C20(VSS87) U1.C22(VSS89) U1.C24(VSS90) U1.C26(VSS91) U1.E3(VSS96) U1.E27(VSS95) U1.G3(VSS11) U1.G6(VSS98) U1.G24(VSS97) U1.G27(VSS10) U1.H8(VSS107) U1.H10(VSS100) U1.H12(VSS101) U1.H14(VSS102) U1.H16(VSS103) U1.H18(VSS104) U1.H20(VSS105) U1.H22(VSS106) U1.J3(VSS3) U1.J7(VSS4) U1.J23(VSS108) U1.J27(VSS109) U1.L3(VSS9) U1.L7(VSS1) U1.L14(VSS5) U1.L16(VSS6) U1.L23(VSS7) U1.L27(VSS8) U1.M11(VSS22) U1.M19(VSS33) U1.N3(VSS88) U1.N7(VSS99) U1.N11(VSS44) U1.N19(VSS55) U1.N23(VSS66) U1.N27(VSS77) U1.P11(VSS2) U1.P19(VSS13) U1.R3(VSS25) U1.R7(VSS26) U1.R11(VSS14) U1.R12(VSS15) U1.R13(VSS16) U1.R14(VSS17) U1.R16(VSS18) U1.R17(VSS19) U1.R18(VSS20) U1.R19(VSS21) U1.R23(VSS23) U1.R27(VSS24) U1.T11(VSS27) U1.T19(VSS28) U1.U3(VSS35) U1.U7(VSS36) U1.U11(VSS29) U1.U18(VSS30) U1.U19(VSS31) U1.U23(VSS32) U1.U27(VSS34) U1.V11(VSS37) U1.V19(VSS38) U1.W3(VSS43) U1.W7(VSS45) U1.W14(VSS39) U1.W16(VSS40) U1.W23(VSS41) U1.W27(VSS42)
NVCC_DRAM_1V1: C54.2 C55.2 C56.2 C57.2 C58.2 C59.2 C60.2 C61.2 C62.2 U1.AA8(NVCC_DRAM_2) U1.AA10(NVCC_DRAM_1) U1.J8(NVCC_DRAM_4) U1.J10(NVCC_DRAM_3) U1.L8(NVCC_DRAM_5) U1.N8(NVCC_DRAM_6) U1.R8(NVCC_DRAM_7) U1.U8(NVCC_DRAM_8) U1.W8(NVCC_DRAM_9)
NVCC_SD2: C17.2 U1.W24(NVCC_SD2)
NVCC_SNVS_1V8: C5.2 U1.R24(NVCC_SNVS_1P8)
VDD_1V8: C1.2 C2.2 C3.2 C4.2 C8.2 C9.2 C10.2 C16.2 C24.2 U1.AA11(NVCC_SAI2_SAI3_SPDIF) U1.AA14(NVCC_ECSPI_HDMI) U1.AA16(PVCC2_1P8) U1.AA19(PVCC1_1P8) U1.AA24(NVCC_ENET) U1.J11(NVCC_GPIO) U1.J16(PVCC0_1P8) U1.K11(NVCC_JTAG) U1.R22(NVCC_CLK) U1.U22(NVCC_NAND) U1.U24(NVCC_SD1) U1.Y10(NVCC_I2C_UART) U1.Y11(NVCC_SAI1_SAI5)
VDD_3V3: C18.2 U1.J14(VDD_USB_3P3)
VDD_ARM: C11.2 C12.2 C13.2 C14.2 C15.2 C19.2 C20.2 C21.2 C22.2 C23.2 U1.T14(VDD_ARM_1) U1.T16(VDD_ARM_2) U1.U12(VDD_ARM_3) U1.U13(VDD_ARM_4) U1.U14(VDD_ARM_5) U1.U15(VDD_ARM_6) U1.U16(VDD_ARM_7) U1.U17(VDD_ARM_8) U1.V14(VDD_ARM_9) U1.V16(VDD_ARM_10) U1.W12(VDD_ARM_11) U1.W13(VDD_ARM_12) U1.W17(VDD_ARM_13) U1.Y14(VDD_ARM_14) U1.Y15(VDD_ARM_15) U1.Y16(VDD_ARM_16)  [also labelled VDD_ARM_S]
VDD_SNVS_0V8: C6.2 U1.N26(VDD_SNVS_0P8_CAP)
VDD_SOC: C25.2 C26.2 C27.2 C28.2 C29.2 C30.2 C31.2 C32.2 C38.2 C39.2 C40.2 C41.2 C46.2 C47.2 C48.2 C49.2 C50.2 C51.2 C52.2 C53.2 TP1.1 U1.K10(VDD_SOC_1) U1.K14(VDD_USB_0P8) U1.K15(VDD_PCI_0P8) U1.K16(VDD_MIPI_0P8) U1.L9(VDD_SOC_11) U1.L10(VDD_SOC_2) U1.L11(VDD_SOC_3) U1.L12(VDD_SOC_4) U1.L13(VDD_SOC_5) U1.L17(VDD_SOC_6) U1.L18(VDD_SOC_7) U1.L19(VDD_SOC_8) U1.L20(VDD_SOC_9) U1.L21(VDD_SOC_10) U1.M14(VDD_SOC_12) U1.M16(VDD_SOC_13) U1.N9(VDD_SOC_28) U1.N10(VDD_SOC_14) U1.N12(VDD_SOC_15) U1.N13(VDD_SOC_16) U1.N14(VDD_SOC_34) U1.N15(VDD_SOC_33) U1.N16(VDD_SOC_32) U1.N17(VDD_SOC_31) U1.N18(VDD_SOC_30) U1.N20(VDD_SOC_29) U1.N21(VDD_SOC_35) U1.P14(VDD_SOC_27) U1.P16(VDD_SOC_26) U1.R9(VDD_DRAM_PLL_0P8) U1.R10(VDD_SOC_25) U1.R20(VDD_SOC_24) U1.R21(VDD_ANA1_0P8) U1.U9(VDD_SOC_20) U1.U10(VDD_SOC_23) U1.U20(VDD_SOC_22) U1.U21(VDD_SAI_PLL_0P8) U1.W9(VDD_SOC_17) U1.W10(VDD_SOC_19) U1.W11(VDD_SOC_18) U1.W20(VDD_SOC_21) U1.W21(VDD_ARM_PLL_0P8) U1.W22(VDD_HDMI_0P8)  [also labelled VDD_SOC_S]
VDDA_1V8: C7.2 C33.2 C34.2 C35.2 C36.2 C37.2 C42.2 C43.2 C44.2 C45.2 U1.AA20(VDD_EARC_1P8) U1.AA22(VDD_HDMI_1P8) U1.J19(VDD_USB_1P8) U1.J20(VDD_ANA0_1P8) U1.J22(VDD_LVDS_1P8) U1.K19(VDD_PCI_1P8) U1.K20(VDD_MIPI_1P8) U1.L22(VDD_24M_XTAL_1P8) U1.N22(VDD_ANA1_1P8) U1.R6(VDD_DRAM_PLL_1P8) U1.W18(VDD_SAI_PLL_1P8) U1.W19(VDD_AVPLL_1P8) U1.Y19(VDD_ARM_PLL_1P8) U1.Y20(VDD_ANA2_1P8)
VDD_MIPI_1V2_CAP: C63.2 U1.F20(VDD_MIPI_1P2_CAP)

### Notes on the sheet
- CPU Power
- PMIC Sense Point
- (near C23) PMIC Sense Point
- (near TP1) TEST Point
- PCB Des :
- Approv By :
- Project Title :
- Sheet Title :
- Date :
- Page :
- PCB Version :
- PCB Revision :
- Size :
- A2
- (in symbol IC_MPU_8M_PLUS_MIMX8ML8DVNLZAB, part N) i.MX8MP - Power
- (in symbol IC_MPU_8M_PLUS_MIMX8ML8DVNLZAB, part O) i.MX8MP - GND

### Library data of the parts
C1 C11 C19 C25 C29 C33 C38 C46 C54 C58 = CAP_10UF_6.3V_X5R_0402: Cap Ceramic 10uF 6.3V X5R 20% SMD 0402 85C T/R; Manufacturer: Samsung; Supplier 1: Digikey; Manufacturer Part Number: CL05A106MQ5NUNC; RoHS: Yes; Category: Ceramic Capacitors; Stock 1: 6097180; Pricing 1: 1=0.24, 10=0.153, 50=0.0968, 100=0.0774, 500=0.05588, 1000=0.04943, 2500=0.04728, 5000=0.04299 (USD); Mount: Surface Mount; Case Code (Metric): 1005; Case Code (Imperial): 0402; Min Operating Temperature: -55°C; Max Operating Temperature: 85°C; Packaging: Tape and Reel; Tolerance: 20%; Dielectric: X5R; Series: CL; Package Quantity: 1; Construction: Flat; Length: 1mm; Width: 0.02inch; Height: 0.5mm; Depth: 0.5mm; Thickness: 0.028inch; Radiation Hardening: No; RoHS Compliant: Yes; ComponentLink1URL: https://datasheet.ciiva.com/16437/cl05a106mq5nunc-16437356.pdf?src-supplier=Future+Electronics; ComponentLink1Description: https://datasheet.ciiva.com/16437/cl05a106mq5nunc-16437356.pdf?src-supplier=Future+Electronics; ComponentLink2URL: https://datasheet.ciiva.com/26877/getdatasheetpartid-355289-26877841.pdf?src-supplier=Verical; ComponentLink2Description: https://datasheet.ciiva.com/26877/getdatasheetpartid-355289-26877841.pdf?src-supplier=Verical; Supplier Part Number 1: 1276-1451-1-ND
C2-C10 C12-C16 C20-C24 C26-C28 C30-C32 C34-C37 C39-C45 C47-C53 C55-C57 C59-C62 = CAP_1UF_6.3V_X5R_0201: 0201 1 uF 6.3 V ±20 % Tolerance X5R Surface Mount Multilayer Ceramic Capacitor; Manufacturer: Kyocera AVX; Tolerance: 20%; Supplier 1: Mouser; Manufacturer Part Number: 02016D105MAT2A; RoHS: Yes; Category: Ceramic Capacitors; Stock 1: 1026413; Pricing 1: 1=0.1, 10=0.028, 50=0.028, 100=0.014, 1000=0.008, 10000=0.006 (USD); Mount: Surface Mount; Number of Pins: 2; Case Code (Metric): 0603; Case Code (Imperial): 0201; Min Operating Temperature: -55°C; Max Operating Temperature: 85°C; Packaging: Cut Tape; Series: -; Voltage Rating: 6.3V; Package Quantity: 1; Length: 0.024inch; Width: 0.012inch; Thickness: 0.013inch; Depth: 0.3mm; Lead Free: Lead Free; RoHS Compliant: Yes; Reach SVHC Compliant: No; ComponentLink1URL: https://datasheet.ciiva.com/6265/cx5r-6265595.pdf?src-supplier=Digi-Key; ComponentLink1Description: https://datasheet.ciiva.com/6265/cx5r-6265595.pdf?src-supplier=Digi-Key; ComponentLink2URL: https://datasheet.ciiva.com/1123/1666675-1123122.pdf?src-supplier=Element14; ComponentLink2Description: https://datasheet.ciiva.com/1123/1666675-1123122.pdf?src-supplier=Element14; ComponentLink3URL: https://datasheet.ciiva.com/14891/cx5r-14891029.pdf?src-supplier=Digi-Key; ComponentLink3Description: https://datasheet.ciiva.com/14891/cx5r-14891029.pdf?src-supplier=Digi-Key; ComponentLink4URL: https://datasheet.ciiva.com/7614/cx5r-7614682.pdf?src-supplier=Digi-Key; ComponentLink4Description: https://datasheet.ciiva.com/7614/cx5r-7614682.pdf?src-supplier=Digi-Key; ComponentLink5URL: https://datasheet.ciiva.com/14891/cx5r-14891030.pdf?src-supplier=Digi-Key; ComponentLink5Description: https://datasheet.ciiva.com/14891/cx5r-14891030.pdf?src-supplier=Digi-Key; Supplier Part Number 1: 581-02016D105MAT2A; Dielectric: X5R
C17 C18 = CAP_0.22UF_10V_X5R_0201: Multilayer Ceramic Capacitors (High dielectric type), 10V, 0.22 uF, ± 20 %, 0201, X5R, RoHS; Manufacturer: Taiyo Yuden; Material: 4241ConductorMaterial; Tolerance: 20%; Supplier 1: Digikey; Manufacturer Part Number: LMK063BJ224MP-F; RoHS: Yes; Category: Ceramic Capacitors; Stock 1: 6053224; Pricing 1: 1=0.12, 10=0.08, 50=0.0478, 100=0.0375, 500=0.02772, 1000=0.02295, 2500=0.02136, 5000=0.01954 (USD); Mount: Surface Mount; Case Code (Metric): 0603; Case Code (Imperial): 0201; Min Operating Temperature: -55°C; Max Operating Temperature: 85°C; Voltage Rating: 10V; Packaging: Tape and Reel; Package Quantity: 15000; Dielectric: X5R; Termination: SMD/SMT; Voltage: 10V; Series: M; Construction: Flat; Length: 0.6mm; Width: 0.3mm; Height: 0.3mm; Depth: 0.3mm; Radiation Hardening: No; Halogen Free: Halogen Free; RoHS Compliant: Yes; Reach SVHC Compliant: Unknown; ComponentLink1URL: https://datasheet.ciiva.com/134/lmk063bj224mp-f-ss-134995.pdf?src-supplier=Digikey; ComponentLink1Description: https://datasheet.ciiva.com/134/lmk063bj224mp-f-ss-134995.pdf?src-supplier=Digikey; ComponentLink2URL: https://datasheet.ciiva.com/11464/lmk063bj224mp-f-ss-11464053.pdf?src-supplier=Avnet; ComponentLink2Description: https://datasheet.ciiva.com/11464/lmk063bj224mp-f-ss-11464053.pdf?src-supplier=Avnet; ComponentLink3URL: https://datasheet.ciiva.com/15921/1589lmk063bj224mp-f-15921250.pdf?src-supplier=Onlinecomponents.com; ComponentLink3Description: https://datasheet.ciiva.com/15921/1589lmk063bj224mp-f-15921250.pdf?src-supplier=Onlinecomponents.com; ComponentLink4URL: https://datasheet.ciiva.com/26872/getdatasheetpartid-639019-26872592.pdf?src-supplier=Verical; ComponentLink4Description: https://datasheet.ciiva.com/26872/getdatasheetpartid-639019-26872592.pdf?src-supplier=Verical; ComponentLink5URL: https://datasheet.ciiva.com/30243/100lmk063bj224mp-f-30243150.pdf?src-supplier=Onlinecomponents.com; ComponentLink5Description: https://datasheet.ciiva.com/30243/100lmk063bj224mp-f-30243150.pdf?src-supplier=Onlinecomponents.com; ComponentLink6URL: https://datasheet.ciiva.com/28645/746258-28645141.pdf?src-supplier=Element14; ComponentLink6Description: https://datasheet.ciiva.com/28645/746258-28645141.pdf?src-supplier=Element14; ComponentLink7URL: https://datasheet.ciiva.com/5422/mlcc-all-e-541559-5422365.pdf?src-supplier=Mouser; ComponentLink7Description: https://datasheet.ciiva.com/5422/mlcc-all-e-541559-5422365.pdf?src-supplier=Mouser; Supplier Part Number 1: 587-2483-1-ND
C63 = CAP_4.7UF_6.3V_X5R_0402: Multilayer Ceramic Capacitor, 4.7 uF, 6.3 V, ± 20%, X5R, 0402 [1005 Metric]; Manufacturer: TDK; Material: 4241ConductorMaterial; Dissipation Factor: 10%; Supplier 1: Digi-Key; Manufacturer Part Number: C1005X5R0J475M050BC; RoHS: Yes; Category: Ceramic Capacitors; Stock 1: 799722; Pricing 1: 1=0.35, 10=0.233, 50=0.1716, 100=0.1396, 500=0.11024, 1000=0.0931, 2500=0.0882, 5000=0.0833 (USD); Mount: Surface Mount; Dielectric Material: Ceramic; Case Code (Metric): 1005; Case Code (Imperial): 0402; Weight: 2.3E-05oz; Min Operating Temperature: -55°C; Max Operating Temperature: 85°C; Packaging: Tape and Reel; Tolerance: 20%; Voltage Rating (DC): 6.3V; Dielectric: X5R; Package Quantity: 1; Termination: SMD/SMT; Voltage: 6.3V; Series: C; Construction: Flat; Length: 1mm; Width: 0.02inch; Height: 0.5mm; Depth: 0.5mm; Thickness: 0.026inch; Lead Free: Lead Free; Reach SVHC Compliant: No; RoHS Compliant: Yes; ComponentLink1URL: https://datasheet.ciiva.com/24216/c1005x5r0j475m050bc-264348-24216583.pdf?src-supplier=Mouser; ComponentLink1Description: https://datasheet.ciiva.com/24216/c1005x5r0j475m050bc-264348-24216583.pdf?src-supplier=Mouser; ComponentLink2URL: https://datasheet.ciiva.com/5962/639999-5962567.pdf?src-supplier=Farnell; ComponentLink2Description: https://datasheet.ciiva.com/5962/639999-5962567.pdf?src-supplier=Farnell; ComponentLink3URL: https://datasheet.ciiva.com/22648/1796654-22648701.pdf?src-supplier=Element14; ComponentLink3Description: https://datasheet.ciiva.com/22648/1796654-22648701.pdf?src-supplier=Element14; ComponentLink4URL: https://datasheet.ciiva.com/22749/1744655-22749711.pdf?src-supplier=Element14; ComponentLink4Description: https://datasheet.ciiva.com/22749/1744655-22749711.pdf?src-supplier=Element14; ComponentLink5URL: https://datasheet.ciiva.com/7770/639999-7770124.pdf?src-supplier=Element14; ComponentLink5Description: https://datasheet.ciiva.com/7770/639999-7770124.pdf?src-supplier=Element14; ComponentLink6URL: https://datasheet.ciiva.com/6289/tdkmlcccaprange-6289886.pdf?src-supplier=Digi-Key; ComponentLink6Description: https://datasheet.ciiva.com/6289/tdkmlcccaprange-6289886.pdf?src-supplier=Digi-Key; ComponentLink7URL: https://datasheet.ciiva.com/6289/tdkmlcccaprange-6289895.pdf?src-supplier=Digi-Key; ComponentLink7Description: https://datasheet.ciiva.com/6289/tdkmlcccaprange-6289895.pdf?src-supplier=Digi-Key; ComponentLink8URL: https://datasheet.ciiva.com/16425/e412-c-16425670.pdf?src-supplier=Future+Electronics; ComponentLink8Description: https://datasheet.ciiva.com/16425/e412-c-16425670.pdf?src-supplier=Future+Electronics; Supplier Part Number 1: 445-7395-1-ND
TP1 TP2 = TP_PAD_SMD_Round: Test Point, SMD pad, round, 1.5mm, 1.6mm, 3mm diameter
U1 = IC_MPU_8M_PLUS_MIMX8ML8DVNLZAB: i.MX 8M Plus, Consumer, / TRAY TRAY MULTIPLE DP BAKEABLE RoHS Compliant: Yes; Manufacturer: NXP Semiconductors; Supplier 1: Arrow Electronics; Manufacturer Part Number: MIMX8ML8DVNLZAB; RoHS: Yes; Category: Microprocessors; Stock 1: 1036; Pricing 1: 1=54.8, 5=52.24, 10=44.19, 25=42.8, 50=39.95, 100=31.83 (USD); Supplier Part Number 1: MIMX8ML8DVNLZAB

## Sheet PERIPHERALS.SchDoc: CONNECTOR A
size A2; DrawnBy: UKAYACIK; Engineer: UKAYACIK; DocumentNumber: 12; Revision: B; SheetNumber: 14; SheetTotal: 21
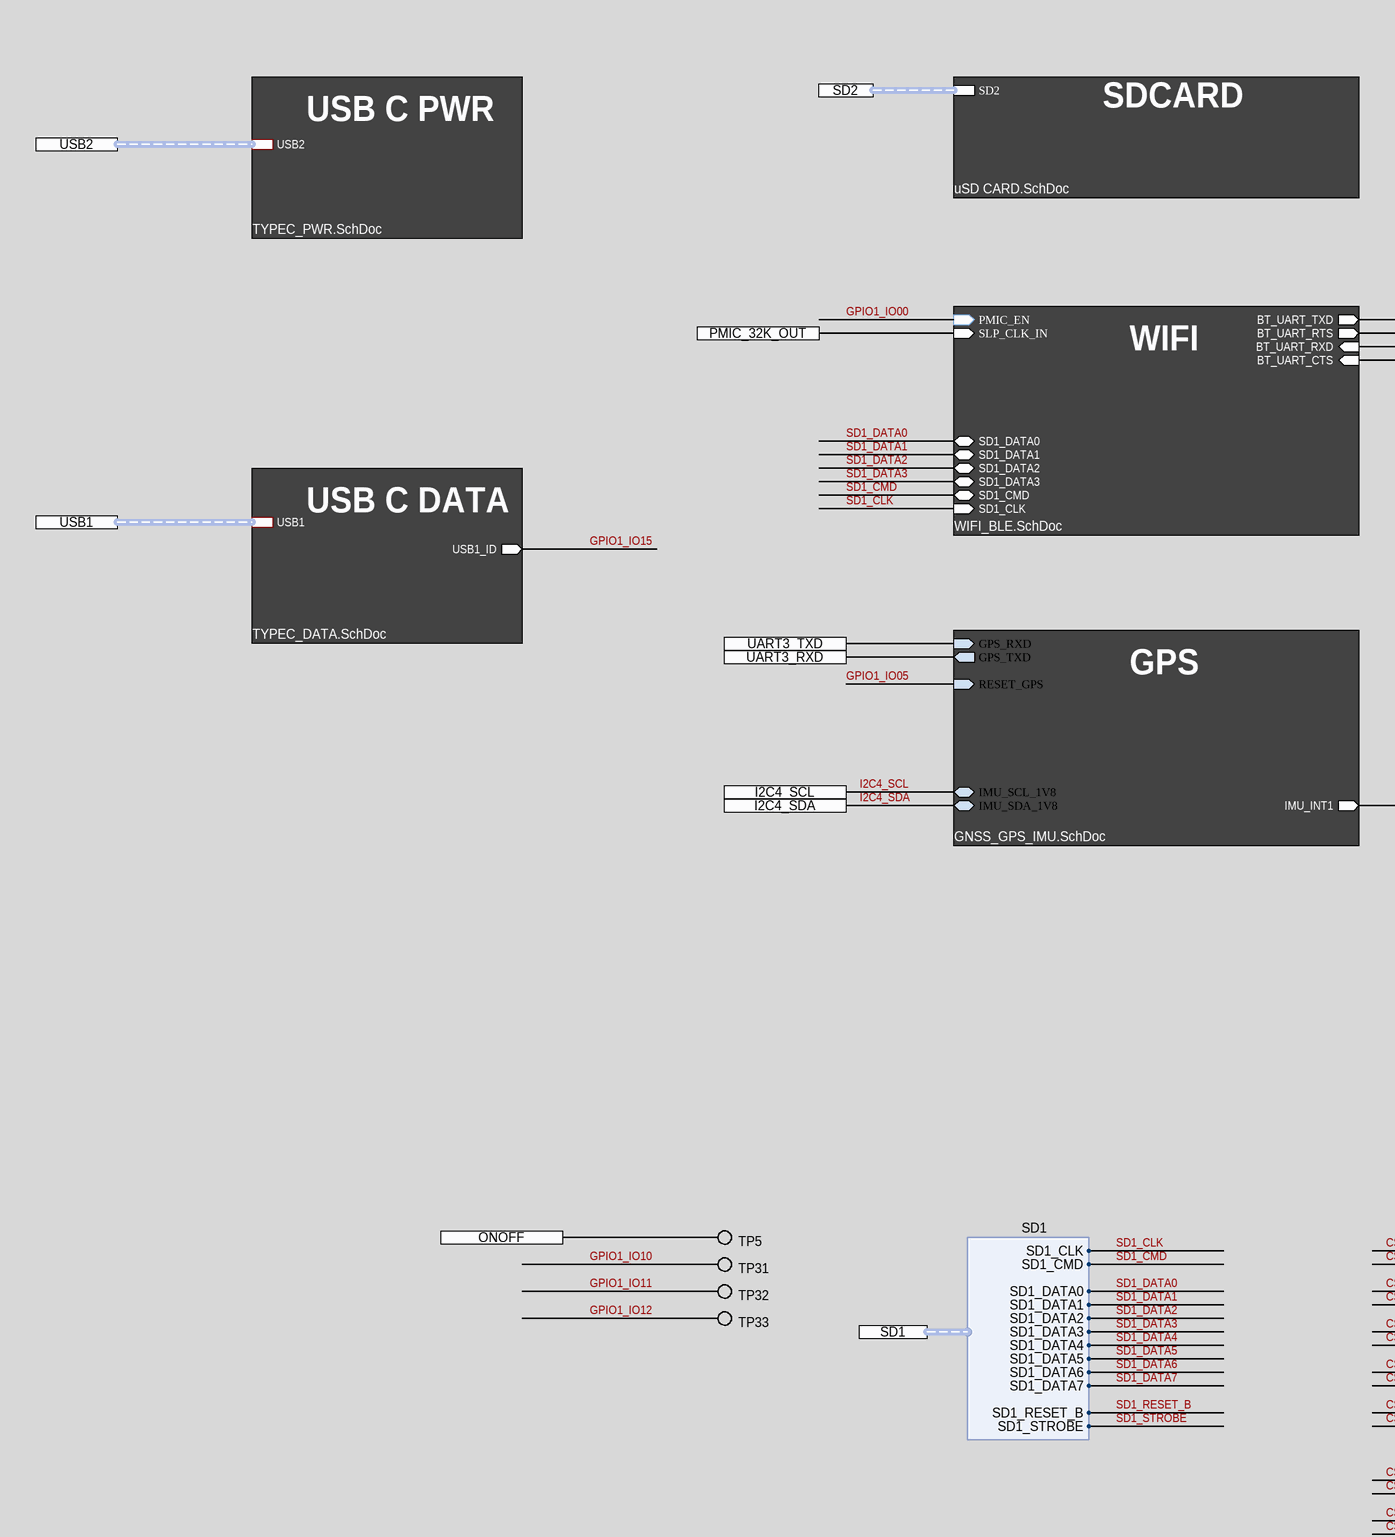
[diagram p9: PERIPHERALS.SchDoc, left]
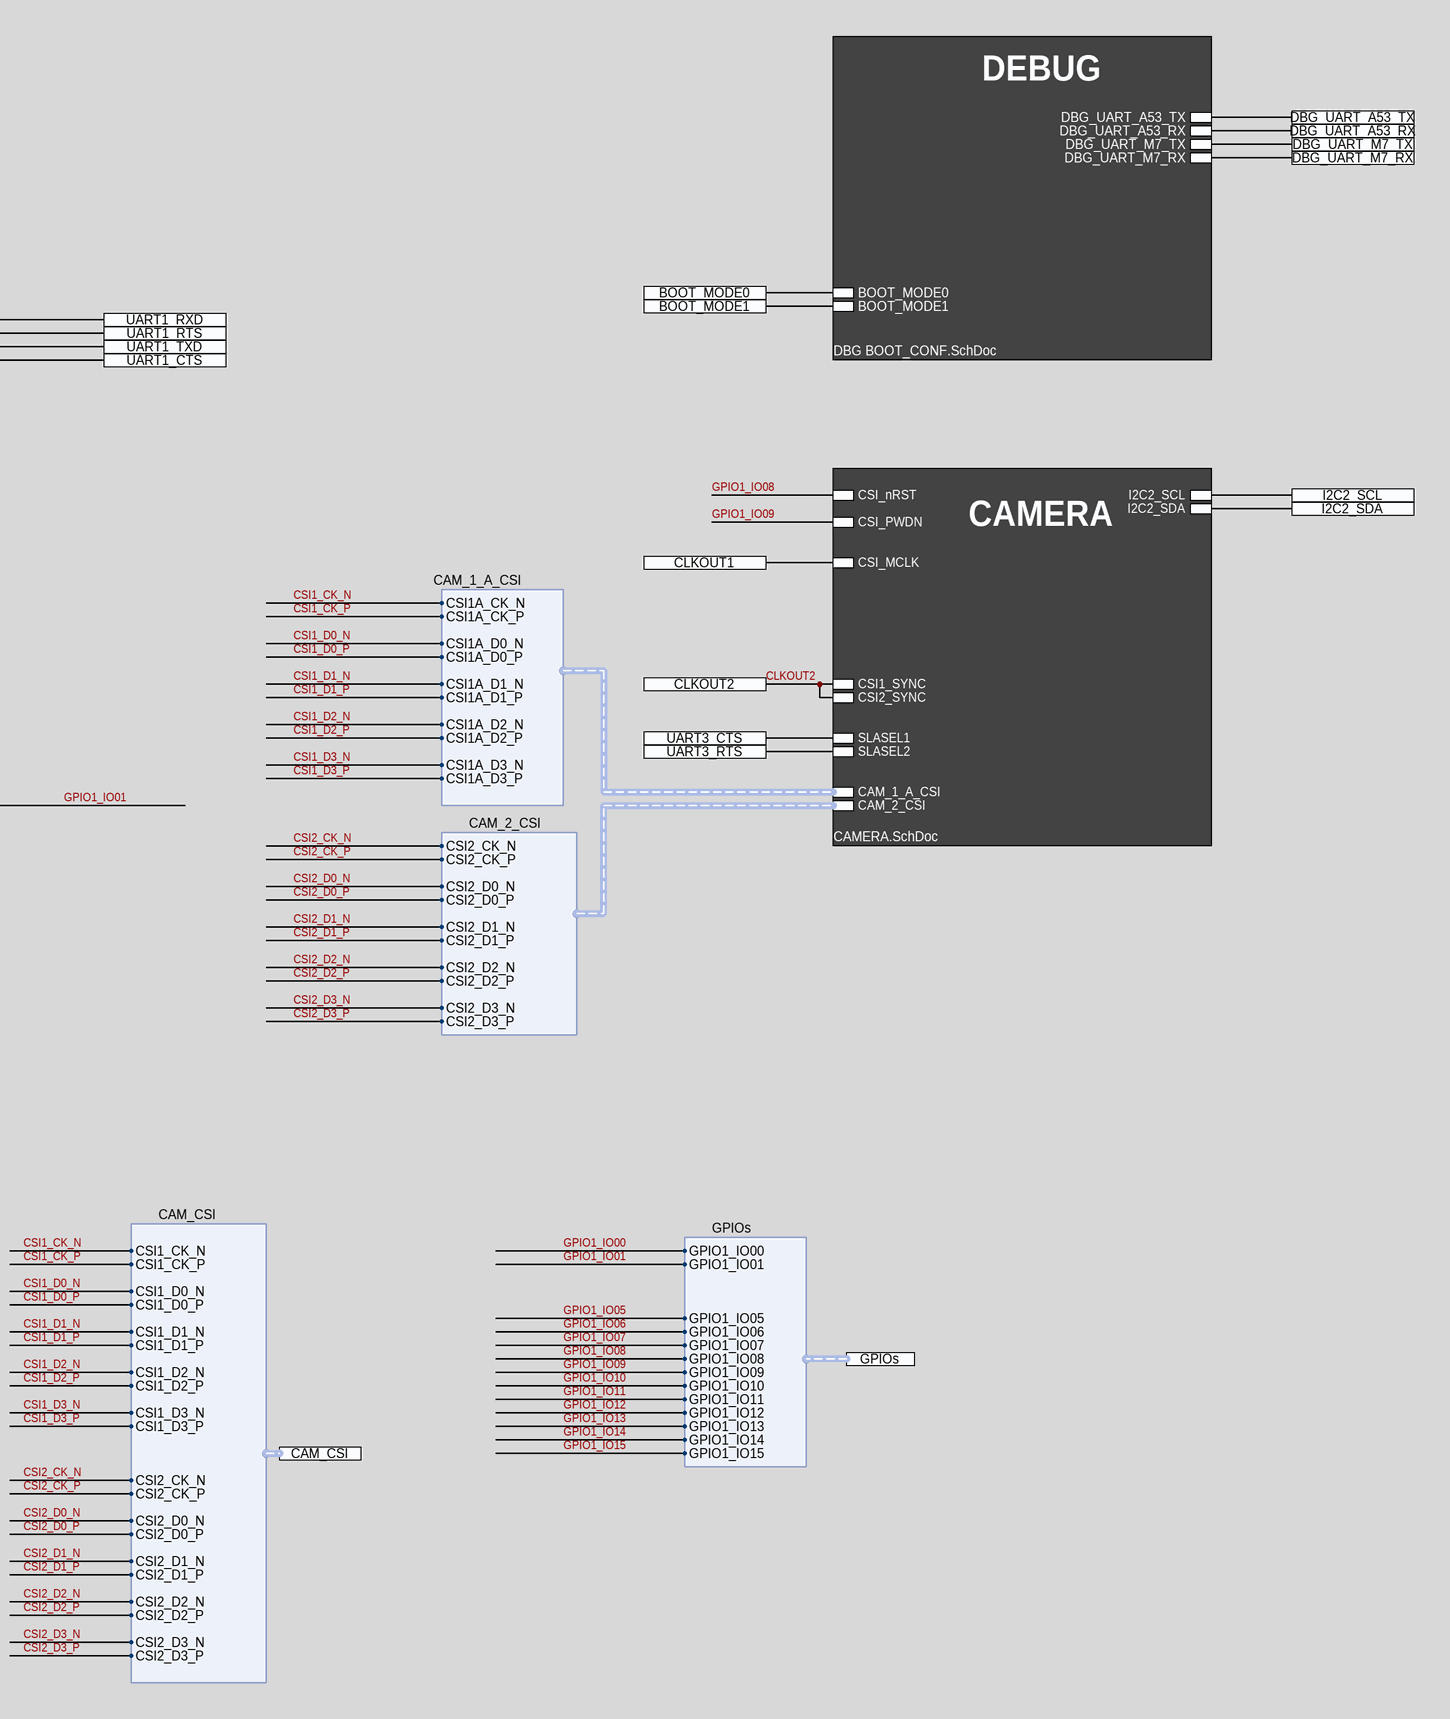
[diagram p10: PERIPHERALS.SchDoc, right]

### Parts
TP5  NO COMPONENT  [TP_PAD_0.5MM_SMD_ROUND]  (value not drawn)  (no BOM)
TP31  NO COMPONENT  [TP_PAD_0.5MM_SMD_ROUND]  (value not drawn)  (no BOM)
TP32  NO COMPONENT  [TP_PAD_0.5MM_SMD_ROUND]  (value not drawn)  (no BOM)
TP33  NO COMPONENT  [TP_PAD_0.5MM_SMD_ROUND]  (value not drawn)  (no BOM)

### Sub-sheets
Designator = TYPEC_PWR.SchDoc: USB2 (harness USB1)
Designator = TYPEC_DATA.SchDoc: USB1 (harness USB1), USB1_ID (out)
U_CAMERA = CAMERA.SchDoc: CSI_PWDN, CSI1_SYNC, CSI_MCLK, CSI_nRST, I2C2_SDA, I2C2_SCL, SLASEL1, CSI2_SYNC, SLASEL2, CAM_2_CSI (harness CAM_2_CSI), CAM_1_A_CSI (harness CAM_1_A_CSI)
U_DBG BOOT_CONF = DBG BOOT_CONF.SchDoc: DBG_UART_A53_TX, DBG_UART_A53_RX, DBG_UART_M7_RX, DBG_UART_M7_TX, BOOT_MODE0, BOOT_MODE1
U_GNSS_GPS_IMU = GNSS_GPS_IMU.SchDoc: IMU_SCL_1V8 (bidir), IMU_SDA_1V8 (bidir), IMU_INT1 (out), GPS_TXD (out), GPS_RXD (in), RESET_GPS (in)
U_uSD CARD = uSD CARD.SchDoc: SD2 (harness SD2)
U_WIFI_BLE = WIFI_BLE.SchDoc: PMIC_EN (in), SLP_CLK_IN (in), SD1_DATA0 (bidir), SD1_DATA1 (bidir), SD1_DATA2 (bidir), SD1_DATA3 (bidir), SD1_CMD (bidir), SD1_CLK (in), BT_UART_CTS (in), BT_UART_RXD (in), BT_UART_TXD (out), BT_UART_RTS (out)

### Ports
BOOT_MODE0, BOOT_MODE1, CAM_CSI (harness CAM_CSI), CLKOUT1, CLKOUT2, DBG_UART_A53_RX, DBG_UART_A53_TX, DBG_UART_M7_RX, DBG_UART_M7_TX, GPIOs (harness GPIOs), I2C2_SCL, I2C2_SDA, I2C4_SCL, I2C4_SDA, ONOFF, PMIC_32K_OUT, SD1 (harness SD1), SD2 (harness SD2), UART1_CTS, UART1_RTS, UART1_RXD, UART1_TXD, UART3_CTS, UART3_RTS, UART3_RXD, UART3_TXD, USB1 (harness USB1), USB2 (harness USB2)

### Harnesses
SD1: SD1_CMD, SD1_DATA0, SD1_DATA1, SD1_DATA2, SD1_DATA3, SD1_DATA4, SD1_DATA6, SD1_DATA7, SD1_RESET_B, SD1_STROBE, SD1_CLK, SD1_DATA5
CAM_CSI: CSI1_CK_N, CSI1_CK_P, CSI1_D0_N, CSI1_D0_P, CSI1_D1_N, CSI1_D1_P, CSI1_D2_N, CSI1_D2_P, CSI1_D3_N, CSI1_D3_P, CSI2_CK_N, CSI2_CK_P, CSI2_D0_N, CSI2_D0_P, CSI2_D1_N, CSI2_D1_P, CSI2_D2_N, CSI2_D2_P, CSI2_D3_N, CSI2_D3_P
GPIOs: GPIO1_IO00, GPIO1_IO01, GPIO1_IO05, GPIO1_IO06, GPIO1_IO07, GPIO1_IO08, GPIO1_IO09, GPIO1_IO10, GPIO1_IO11, GPIO1_IO12, GPIO1_IO13, GPIO1_IO14, GPIO1_IO15
CAM_2_CSI: CSI2_CK_N, CSI2_CK_P, CSI2_D0_N, CSI2_D0_P, CSI2_D1_N, CSI2_D1_P, CSI2_D2_N, CSI2_D2_P, CSI2_D3_N, CSI2_D3_P
CAM_1_A_CSI: CSI1A_CK_N, CSI1A_CK_P, CSI1A_D0_N, CSI1A_D0_P, CSI1A_D1_N, CSI1A_D1_P, CSI1A_D2_N, CSI1A_D2_P, CSI1A_D3_N, CSI1A_D3_P

### Nets
BOOT_MODE0: port BOOT_MODE0, sheet U_DBG BOOT_CONF/BOOT_MODE0
BOOT_MODE1: port BOOT_MODE1, sheet U_DBG BOOT_CONF/BOOT_MODE1
CLKOUT1: port CLKOUT1, sheet U_CAMERA/CSI_MCLK
CLKOUT2: port CLKOUT2, sheet U_CAMERA/CSI1_SYNC, sheet U_CAMERA/CSI2_SYNC
CSI1_CK_N: port CAM_CSI.CSI1_CK_N, sheet U_CAMERA/CAM_1_A_CSI.CSI1A_CK_N
CSI1_CK_P: port CAM_CSI.CSI1_CK_P, sheet U_CAMERA/CAM_1_A_CSI.CSI1A_CK_P
CSI1_D0_N: port CAM_CSI.CSI1_D0_N, sheet U_CAMERA/CAM_1_A_CSI.CSI1A_D0_N
CSI1_D0_P: port CAM_CSI.CSI1_D0_P, sheet U_CAMERA/CAM_1_A_CSI.CSI1A_D0_P
CSI1_D1_N: port CAM_CSI.CSI1_D1_N, sheet U_CAMERA/CAM_1_A_CSI.CSI1A_D1_N
CSI1_D1_P: port CAM_CSI.CSI1_D1_P, sheet U_CAMERA/CAM_1_A_CSI.CSI1A_D1_P
CSI1_D2_N: port CAM_CSI.CSI1_D2_N, sheet U_CAMERA/CAM_1_A_CSI.CSI1A_D2_N
CSI1_D2_P: port CAM_CSI.CSI1_D2_P, sheet U_CAMERA/CAM_1_A_CSI.CSI1A_D2_P
CSI1_D3_N: port CAM_CSI.CSI1_D3_N, sheet U_CAMERA/CAM_1_A_CSI.CSI1A_D3_N
CSI1_D3_P: port CAM_CSI.CSI1_D3_P, sheet U_CAMERA/CAM_1_A_CSI.CSI1A_D3_P
CSI2_CK_N: port CAM_CSI.CSI2_CK_N, sheet U_CAMERA/CAM_2_CSI.CSI2_CK_N
CSI2_CK_P: port CAM_CSI.CSI2_CK_P, sheet U_CAMERA/CAM_2_CSI.CSI2_CK_P
CSI2_D0_N: port CAM_CSI.CSI2_D0_N, sheet U_CAMERA/CAM_2_CSI.CSI2_D0_N
CSI2_D0_P: port CAM_CSI.CSI2_D0_P, sheet U_CAMERA/CAM_2_CSI.CSI2_D0_P
CSI2_D1_N: port CAM_CSI.CSI2_D1_N, sheet U_CAMERA/CAM_2_CSI.CSI2_D1_N
CSI2_D1_P: port CAM_CSI.CSI2_D1_P, sheet U_CAMERA/CAM_2_CSI.CSI2_D1_P
CSI2_D2_N: port CAM_CSI.CSI2_D2_N, sheet U_CAMERA/CAM_2_CSI.CSI2_D2_N
CSI2_D2_P: port CAM_CSI.CSI2_D2_P, sheet U_CAMERA/CAM_2_CSI.CSI2_D2_P
CSI2_D3_N: port CAM_CSI.CSI2_D3_N, sheet U_CAMERA/CAM_2_CSI.CSI2_D3_N
CSI2_D3_P: port CAM_CSI.CSI2_D3_P, sheet U_CAMERA/CAM_2_CSI.CSI2_D3_P
DBG_UART_A53_RX: port DBG_UART_A53_RX, sheet U_DBG BOOT_CONF/DBG_UART_A53_RX
DBG_UART_A53_TX: port DBG_UART_A53_TX, sheet U_DBG BOOT_CONF/DBG_UART_A53_TX
DBG_UART_M7_RX: port DBG_UART_M7_RX, sheet U_DBG BOOT_CONF/DBG_UART_M7_RX
DBG_UART_M7_TX: port DBG_UART_M7_TX, sheet U_DBG BOOT_CONF/DBG_UART_M7_TX
GPIO1_IO00: sheet U_WIFI_BLE/PMIC_EN, port GPIOs.GPIO1_IO00
GPIO1_IO01: sheet U_GNSS_GPS_IMU/IMU_INT1, port GPIOs.GPIO1_IO01
GPIO1_IO05: sheet U_GNSS_GPS_IMU/RESET_GPS, port GPIOs.GPIO1_IO05
GPIO1_IO08: sheet U_CAMERA/CSI_nRST, port GPIOs.GPIO1_IO08  [project net CSI_nRST_R]
GPIO1_IO09: sheet U_CAMERA/CSI_PWDN, port GPIOs.GPIO1_IO09  [project net CSI_PWDN_R]
GPIO1_IO10: TP31.1 ; port GPIOs.GPIO1_IO10
GPIO1_IO11: TP32.1 ; port GPIOs.GPIO1_IO11
GPIO1_IO12: TP33.1 ; port GPIOs.GPIO1_IO12
GPIO1_IO15: sheet Designator/USB1_ID, port GPIOs.GPIO1_IO15
I2C2_SCL: port I2C2_SCL, sheet U_CAMERA/I2C2_SCL
I2C2_SDA: port I2C2_SDA, sheet U_CAMERA/I2C2_SDA
I2C4_SCL: port I2C4_SCL, sheet U_GNSS_GPS_IMU/IMU_SCL_1V8
I2C4_SDA: port I2C4_SDA, sheet U_GNSS_GPS_IMU/IMU_SDA_1V8
ONOFF: TP5.1 ; port ONOFF
SD1_CLK: sheet U_WIFI_BLE/SD1_CLK, port SD1.SD1_CLK
SD1_CMD: sheet U_WIFI_BLE/SD1_CMD, port SD1.SD1_CMD
SD1_DATA0: sheet U_WIFI_BLE/SD1_DATA0, port SD1.SD1_DATA0
SD1_DATA1: sheet U_WIFI_BLE/SD1_DATA1, port SD1.SD1_DATA1
SD1_DATA2: sheet U_WIFI_BLE/SD1_DATA2, port SD1.SD1_DATA2
SD1_DATA3: sheet U_WIFI_BLE/SD1_DATA3, port SD1.SD1_DATA3
SLASEL1_R: port UART3_CTS, sheet U_CAMERA/SLASEL1
SLASEL2_R: port UART3_RTS, sheet U_CAMERA/SLASEL2
SLP_CLK_IN: port PMIC_32K_OUT, sheet U_WIFI_BLE/SLP_CLK_IN
UART1_CTS: port UART1_RTS, sheet U_WIFI_BLE/BT_UART_RTS
UART1_RTS: port UART1_CTS, sheet U_WIFI_BLE/BT_UART_CTS
UART1_RXD: port UART1_RXD, sheet U_WIFI_BLE/BT_UART_TXD
UART1_TXD: port UART1_TXD, sheet U_WIFI_BLE/BT_UART_RXD
UART3_RXD: port UART3_RXD, sheet U_GNSS_GPS_IMU/GPS_TXD
UART3_TXD: port UART3_TXD, sheet U_GNSS_GPS_IMU/GPS_RXD

### Buses and harness runs
harness port SD2 = sheet U_uSD CARD/SD2
harness port USB1 = sheet Designator/USB1
harness port USB2 = sheet Designator/USB2

### Notes on the sheet
- DEBUG
- USB C PWR
- SDCARD
- WIFI
- USB C DATA
- CAMERA
- GPS
- PCB Des :
- Approv By :
- Project Title :
- Sheet Title :
- Date :
- Page :
- PCB Version :
- PCB Revision :
- Size :
- A2

### Library data of the parts
TP5 TP31-TP33 = TP_PAD_SMD_SMALL: Test Point, SMD pad, round, 1.5mm, 1.6mm, 3mm diameter